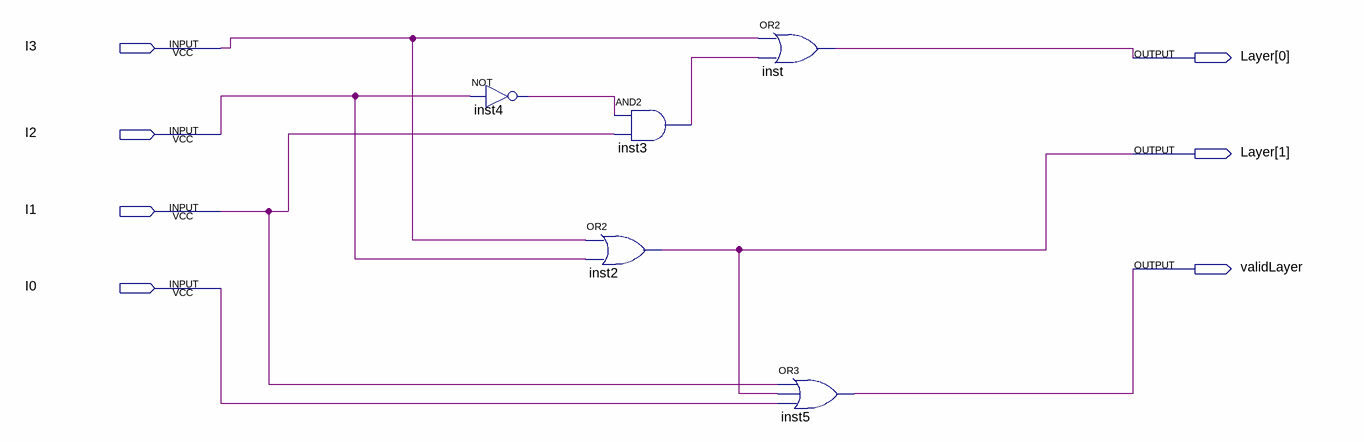
[diagram p0: schematic sheet]
// Quartus schematic pcd_4b.bdf as structural Verilog: 5 symbols, 7 pins
module pcd_4b (
  input  I3,
  input  I2,
  input  I1,
  input  I0,
  output [1:0] Layer,
  output validLayer
);

  wire inst3_out, inst4_out;

  not inst4 (inst4_out, I2);
  or inst2 (Layer[1], I3, I2);
  and inst3 (inst3_out, inst4_out, I1);
  or inst (Layer[0], I3, inst3_out);
  or inst5 (validLayer, I1, Layer[1], I0);
endmodule
